# Altium project SwitchPower.PrjPcb
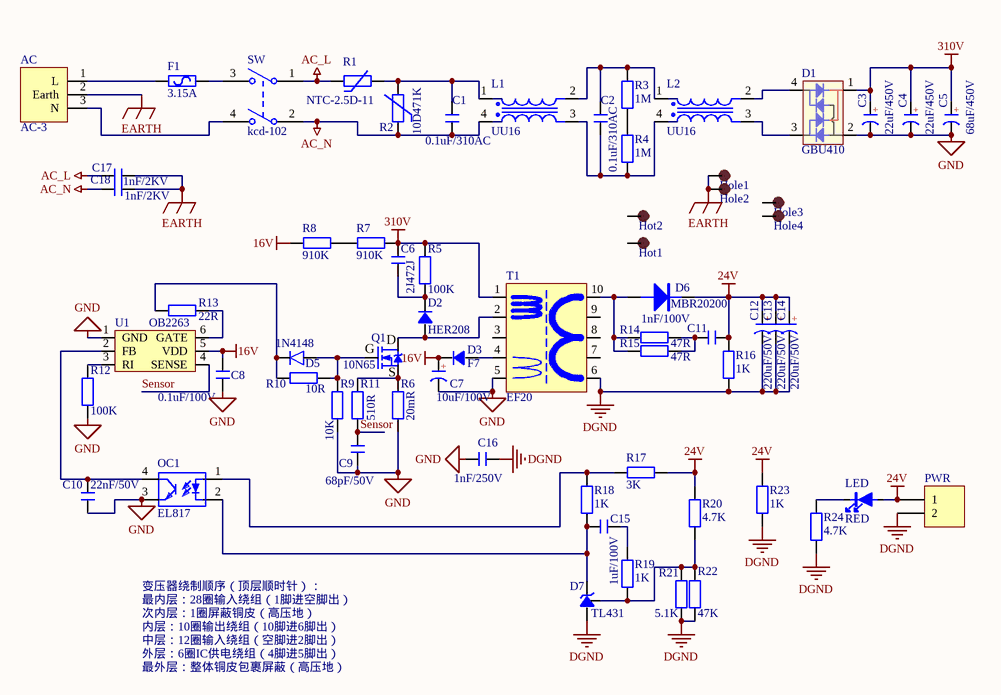
[diagram p0: SwitchPower.SchDoc]
1 sheet, 65 parts. Net scope: global (net labels, ports and power ports of the same name join across sheets).
Board file: SwitchPower.PcbDoc

## Sheet SwitchPower.SchDoc
size A4

### Parts
AC  AC-3  [AC-3_1]
C1  0.1uF/310AC  [CX 10*13*11]
C2  0.1uF/310AC  [CX 10*13*11]
C3  22uF/450V  [CAP 5.0*12.5*20 - GD]
C4  22uF/450V  [CAP 5.0*12.5*20 - GD]
C5  68uF/450V  [CAP 7.5*18*35.5-H - GD]
C6  2J472J  [CBB 5*6.3*3]
C7  10uF/100V  [CAP 2.5*5*11 - GD]
C8  0.1uF/100V  [C 0805_L]
C9  68pF/50V  [C 0805_L]
C10  22nF/50V  [C 0805_L]
C11  1nF/100V  [C 1206_L]
C12  220uF/50V  [CAP 5.0*10*20 - GD]
C13  220uF/50V  [CAP 5.0*10*20 - GD]
C14  220uF/50V  [CAP 5.0*10*20 - GD]
C15  1uF/100V  [C 1206_L]
C16  1nF/250V  [CY 10*14*5]
C17  1nF/2KV  [CY 10*14*5]
C18  1nF/2KV  [CY 10*14*5]
D1  GBU410  [GBU]
D2  HER208  [DO-15V]
D3  F7  [SOD-123F]
D5  1N4148  [SOD-123F]
D6  MBR20200  [TO220A]
D7  TL431  [SOT23-3L]
F1  3.15A  [FU 4x16_V]
Hole1  hole  [M3]  (value not drawn)
Hole2  hole  [M3]  (value not drawn)
Hole3  hole  [M3]  (value not drawn)
Hole4  hole  [M3]  (value not drawn)
Hot1  TEST POINT  [SRP16-24-25]  (value not drawn)
Hot2  TEST POINT  [SRP16-24-25]  (value not drawn)
L1  UU16  [UU10.5]
L2  UU16  [UU10.5]
LED  RED  [LED 0805R]
OC1  EL817  [DIP4-300]
PWR  (no value)  [VH3.96-LI-2P]
Q1  10N65  [TO220A]
R1  NTC-2.5D-11  [VDR NTC2.5D-11]
R2  10D471K  [R VDR-12.5*16.5-T]
R3  1M  [R 1206_L]
R4  1M  [R 1206_L]
R5  100K  [AXIAL0.8-2W-V]
R6  20mR  [AXIAL0.8-2W-V]
R7  910K  [R 1206_L]
R8  910K  [R 1206_L]
R9  10K  [R 1206_L]
R10  10R  [R 0805_L]
R11  510R  [R 1206_L]
R12  100K  [R 0805_L]
R13  22R  [R 1206_L]
R14  47R  [R 1206_L]
R15  47R  [R 1206_L]
R16  1K  [R 1206_L]
R17  3K  [R 0805_L]
R18  1K  [R 0805_L]
R19  1K  [R 0805_L]
R20  4.7K  [R 0805_L]
R21  5.1K  [R 0805_L]
R22  47K  [R 0805_L]
R23  1K  [R 1206_L]
R24  4.7K  [R 1206_L]
SW  kcd-102  [KCD1-104-W]
T1  EF20  [EI28X30]
U1  OB2263  [SOT23-6L]

### Nets
16V: C7.1(A) C8.1 D3.2 R8.1 U1.5(VDD)
24V: C11.1 C12.1(A) C13.1(A) C14.1(A) D6.2(K) LED.1 PWR.1 R16.1 R17.1 R20.2 R23.1
310V: C3.1(A) C4.1(A) C5.1(A) C6.2 D1.1(+) R5.2 R7.2 T1.1(GND)
AC_L: C17.2 R1.1 SW.1
AC_N: C1.1 C18.2 L1.4 R2.1 SW.2
DGND: C12.2(K) C13.2(K) C14.2(K) C16.1 D7.3 PWR.2 R16.2 R21.1 R22.1 R23.2 R24.2 T1.6(DRAIN)
EARTH: AC.2(Earth) C17.1 C18.1 Hole1.1 Hole2.1
GND: C3.2(K) C4.2(K) C5.2(K) C7.2(K) C8.2 C9.2 C10.2 C16.2 D1.2(-) OC1.3(E) R6.1 R9.1 R12.1 T1.5(DRAIN) U1.1(GND)
Sensor: C9.1 R11.1 U1.4(SENSE)
NetAC_1: AC.1(L) F1.1
NetAC_3: AC.3(N) SW.4
NetC1_2: C1.2 L1.1 R1.2 R2.2
NetC2_1: C2.1 L1.3 L2.4 R4.1
NetC2_2: C2.2 L1.2 L2.1 R3.2
NetC6_1: C6.1 D2.2 R5.1
NetC10_1: C10.1 OC1.4(C) U1.2(FB)
NetC11_2: C11.2 R14.1 R15.1
NetC15_1: C15.1 R19.1
NetC15_2: C15.2 D7.2 OC1.2(K) R18.2
NetD1_3: D1.3(AC) L2.3
NetD1_4: D1.4(AC) L2.2
NetD2_1: D2.1 Q1.2(D) T1.2(GND)
NetD3_1: D3.1 T1.4(VCC)
NetD5_1: D5.1 Q1.1(G) R9.2 R10.1
NetD5_2: D5.2 R10.2 R13.2
NetD6_1: D6.1(A) R14.2 R15.2 T1.10(DRAIN)
NetD7_1: D7.1 R19.2 R20.1 R21.2 R22.2
NetF1_2: F1.2 SW.3
NetLED_2: LED.2 R24.1
NetOC1_1: OC1.1(A) R17.2 R18.1
NetQ1_3: Q1.3(S) R6.2 R11.2
NetR3_1: R3.1 R4.2
NetR7_1: R7.1 R8.2
NetR12_2: R12.2 U1.3(RI)
NetR13_1: R13.1 U1.6(GATE)

Not connected (* = marked no-connect by the designer): Hole3 1; Hole4 1; Hot1 1; Hot2 1; T1 3(NC) 7(NC) 8(NC) 9(NC)

### Notes on the sheet
- 变压器绕制顺序（顶层顺时针）：
- 最内层：28圈输入绕组（1脚进空脚出）
- 内层：10圈输出绕组（10脚进6脚出）
- 中层：12圈输入绕组（空脚进2脚出）
- 次内层：1圈屏蔽铜皮（高压地）
- 外层：6圈IC供电绕组（4脚进5脚出）
- 最外层：整体铜皮包裹屏蔽（高压地）
- (in symbol C-CM) +

### Library data of the parts
AC = AC-3: 交流市电接口3芯
C1 C2 C6 C8-C11 C15-C18 = C: 无极性贴片电容; BOM名称: 无极性贴片电容
C3-C5 C7 C12-C14 = C-CM: 贴片电解电容; BOM名称: 贴片电解电容
D1 = RectifierBridge: 整流桥
D2 D3 = D-US1M: 开关二级管
D5 = D: 二极管
D6 = DIODE: 整流二极管
D7 = TL431: 稳压二极管
F1 = FUSE: 保险丝
Hole1-Hole4 Hot1 Hot2 = TEST-POINT: 测试点
L1 L2 = DLW21SN900SQ2L: 共模电感
LED = LED: 发光二极管
OC1 = EL817: 线性光耦; BOM名称: 线性光耦
PWR = Header 2: Header, 2-Pin; LatestRevisionDate: 17-Jul-2002; LatestRevisionNote: Re-released for DXP Platform.; Publisher: Altium Limited
Q1 = IRFS3607PBF: NMOS 75V+80A 7.4mΩ; BOM名称: N沟场效应管
R1 = R_NTC: 热敏电阻
R2 = R_VDR: 压敏电阻
R3-R24 = R: 贴片电阻
SW = Switch_2: 双刀单掷开关
T1 = EF20: 开关电源变压器
U1 = OB2263: 开关电源IC